# Altium schematic sheet ArbPwrBoost_P3.SchDoc: =ProjectTitle
size B; Engineer: Hab Collector; Organization: Altium Limited; Address1: 3621 Gin Way; Address2: Snellville, GA 30039; SheetNumber: 3; SheetTotal: 8
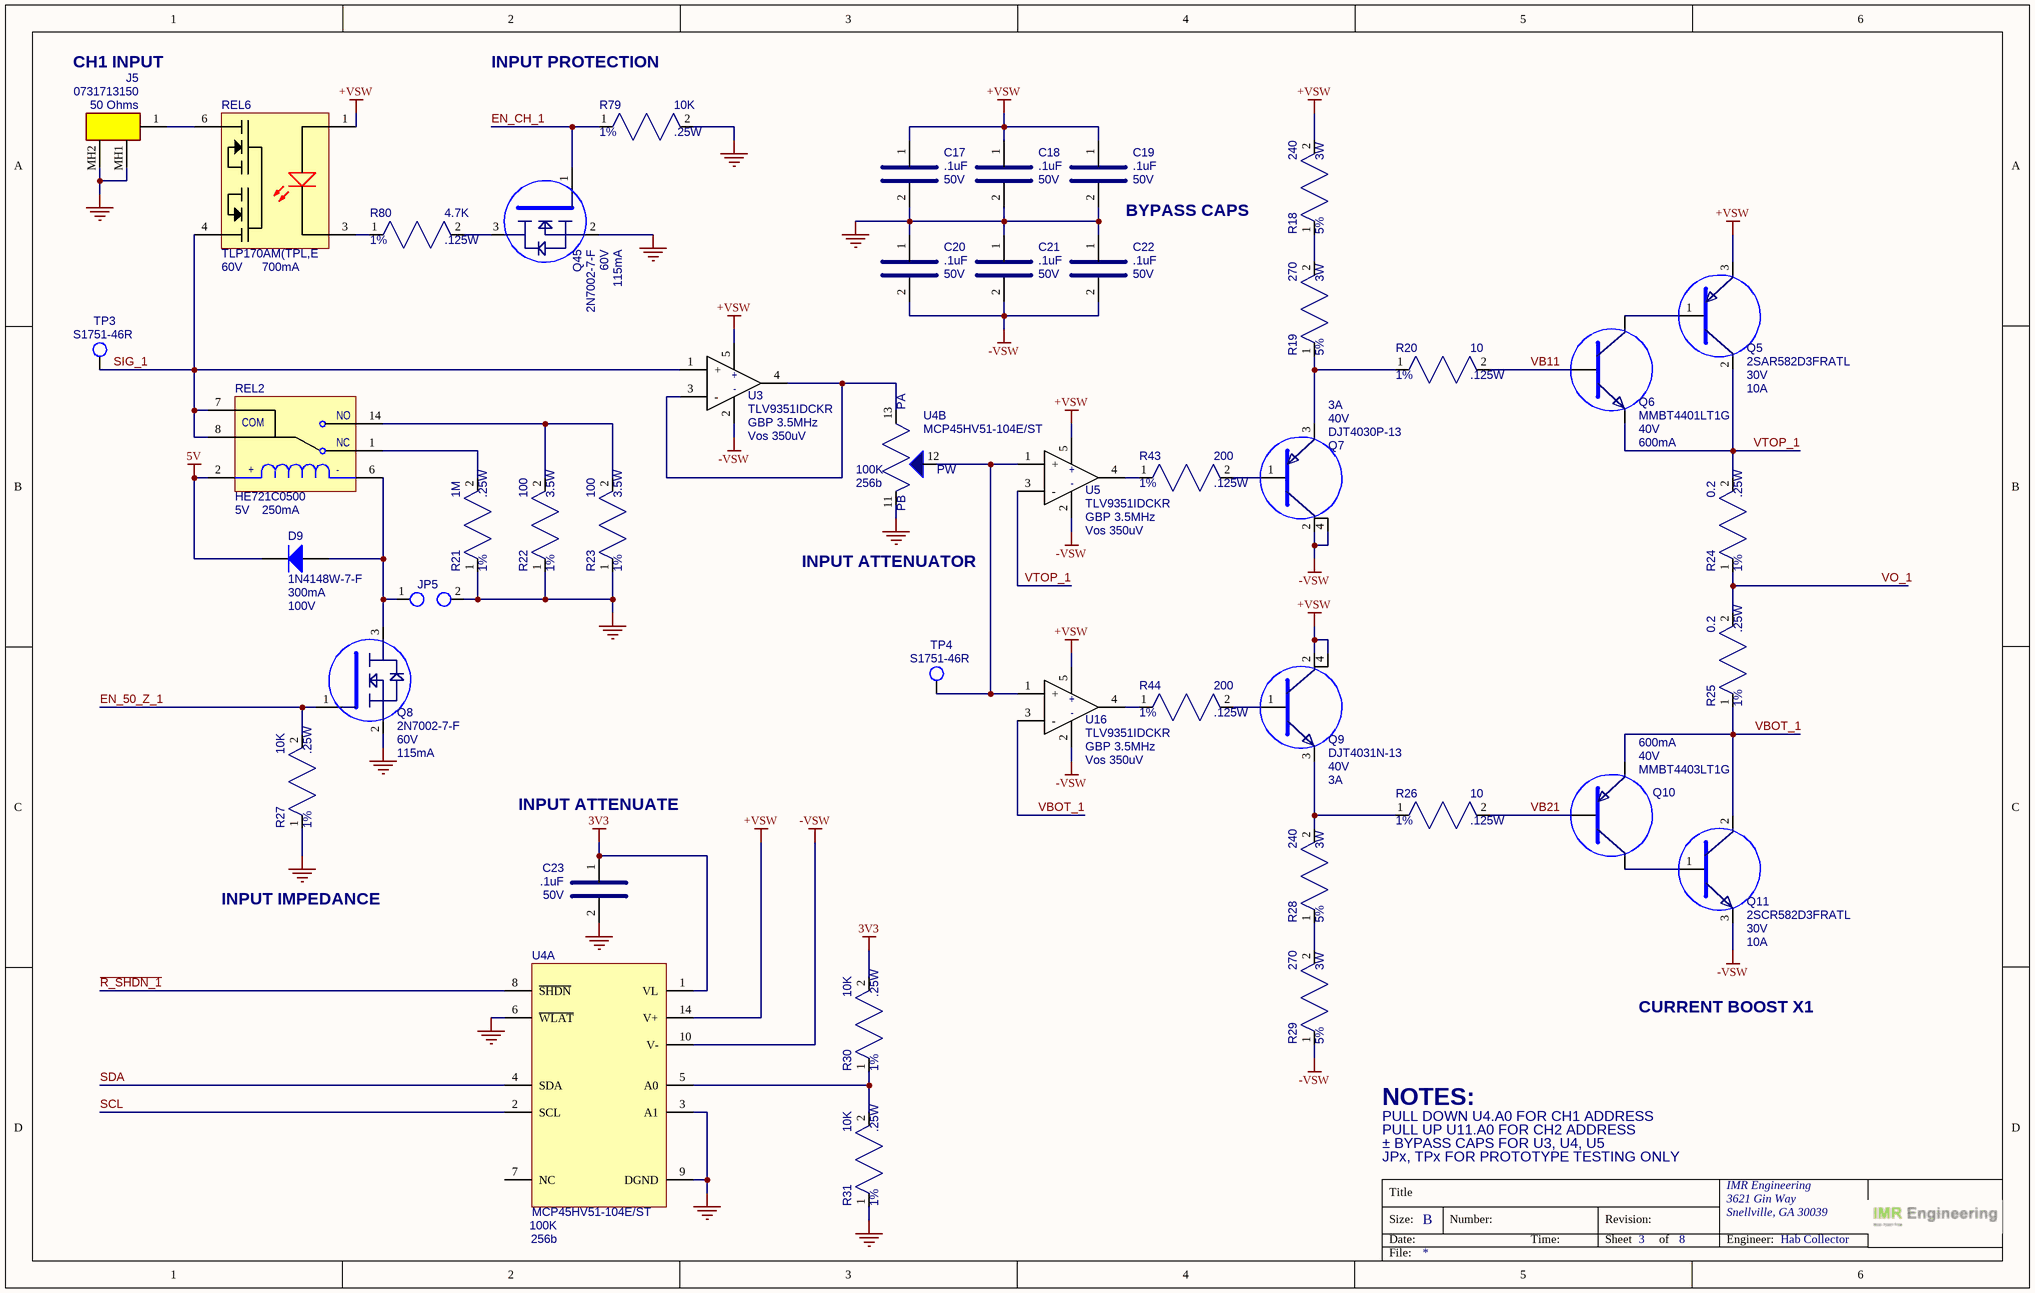
[diagram p0: ArbPwrBoost_P3.SchDoc]

## Parts
C17  value .1uF  Voltage: 50V  [CAP_0805]  (hidden comment: KGM21NR71H104KT)
C18  value .1uF  Voltage: 50V  [CAP_0805]  (hidden comment: KGM21NR71H104KT)
C19  value .1uF  Voltage: 50V  [CAP_0805]  (hidden comment: KGM21NR71H104KT)
C20  value .1uF  Voltage: 50V  [CAP_0805]  (hidden comment: KGM21NR71H104KT)
C21  value .1uF  Voltage: 50V  [CAP_0805]  (hidden comment: KGM21NR71H104KT)
C22  value .1uF  Voltage: 50V  [CAP_0805]  (hidden comment: KGM21NR71H104KT)
C23  value .1uF  Voltage: 50V  [CAP_0805]  (hidden comment: KGM21NR71H104KT)
D9  value 100V  Current: 300mA  [SOD123]  (hidden comment: 1N4148W-7-F)
J5  value 50 Ohms  [731713150]  (hidden comment: 0731713150)
JP5  PREC002SFAN-RC  [HDR_1X2_100MILL]  (value not drawn)
Q5  value 30V  Current: 10A  [TO-252]  (hidden comment: 2SAR582D3FRATL)
Q6  value 40V  Current: 600mA  [SOT-23]  (hidden comment: MMBT4401LT1G)
Q7  value 40V  Current: 3A  [SOT223]  (hidden comment: DJT4030P-13)
Q8  value 60V  Current: 115mA  [SOT-23]  (hidden comment: 2N7002-7-F)
Q9  value 40V  Current: 3A  [SOT223]  (hidden comment: DJT4031N-13)
Q10  value 40V  Current: 600mA  [SOT-23]  (hidden comment: MMBT4403LT1G)
Q11  value 30V  Current: 10A  [TO-252]  (hidden comment: 2SCR582D3FRATL)
Q45  value 60V  Current: 115mA  [SOT-23]  (hidden comment: 2N7002-7-F)
R18  value 240  Power: 3W  Tolerance: 5%  [RES_2512]  (hidden comment: RC2512JK-07240RL)
R19  value 270  Power: 3W  Tolerance: 5%  [RES_2512]  (hidden comment: RC2512JK-07270RL)
R20  value 10  Power: .125W  Tolerance: 1%  [RES_0805]  (hidden comment: RC0805FR-1310RL)
R21  value 1M  Power: .25W  Tolerance: 1%  [RES_0805]  (hidden comment: RC0805FR-7W1ML)
R22  value 100  Power: 3.5W  Tolerance: 1%  [RES_2512]  (hidden comment: ALN2512F100RE-1)
R23  value 100  Power: 3.5W  Tolerance: 1%  [RES_2512]  (hidden comment: ALN2512F100RE-1)
R24  value 0.2  Power: .25W  Tolerance: 1%  [RES_1206]  (hidden comment: RL1206FR-070R2L)
R25  value 0.2  Power: .25W  Tolerance: 1%  [RES_1206]  (hidden comment: RL1206FR-070R2L)
R26  value 10  Power: .125W  Tolerance: 1%  [RES_0805]  (hidden comment: RC0805FR-1310RL)
R27  value 10K  Power: .25W  Tolerance: 1%  [RES_0805]  (hidden comment: RC0805FR-7W10KL)
R28  value 240  Power: 3W  Tolerance: 5%  [RES_2512]  (hidden comment: RC2512JK-07240RL)
R29  value 270  Power: 3W  Tolerance: 5%  [RES_2512]  (hidden comment: RC2512JK-07270RL)
R30  value 10K  Power: .25W  Tolerance: 1%  [RES_0805]  (hidden comment: RC0805FR-7W10KL)
R31  value 10K  Power: .25W  Tolerance: 1%  [RES_0805]  (hidden comment: RC0805FR-7W10KL)
R43  value 200  Power: .125W  Tolerance: 1%  [RES_0805]  (hidden comment: RC0805FR-07200RL)
R44  value 200  Power: .125W  Tolerance: 1%  [RES_0805]  (hidden comment: RC0805FR-07200RL)
R79  value 10K  Power: .25W  Tolerance: 1%  [RES_0805]  (hidden comment: RC0805FR-7W10KL)
R80  value 4.7K  Power: .125W  Tolerance: 1%  [RES_0805]  (hidden comment: RC0805FR-134K7L)
REL2  value 5V  Current: 250mA  [HE700]  (hidden comment: HE721C0500)
REL6  value 60V  Current: 700mA  [SOP-6]  (hidden comment: TLP170AM(TPL,E)
TP3  S1751-46R  [HARWIN_S1751]
TP4  S1751-46R  [HARWIN_S1751]
U3  value GBP 3.5MHz  Vos: Vos 350uV  [SOT-353]  (hidden comment: TLV9351IDCKR)
U4  value 100K  TAP: 256b  [TSSOP-14]  (hidden comment: MCP45HV51-104E/ST)  (parts A,B of 2)
U5  value GBP 3.5MHz  Vos: Vos 350uV  [SOT-353]  (hidden comment: TLV9351IDCKR)
U16  value GBP 3.5MHz  Vos: Vos 350uV  [SOT-353]  (hidden comment: TLV9351IDCKR)

## Nets
3V3: C23.1 R30.2 U4.1(VL)
5V: D9.2(K) REL2.2
+VSW: C17.1 C18.1 C19.1 Q5.3(E) Q9.2(C) Q9.4(C) R18.2 REL6.1 U3.5 U4.14(V+) U5.5 U16.5
-VSW: C20.2 C21.2 C22.2 Q7.2(C) Q7.4(C) Q11.3(E) R29.1 U3.2 U4.10(V-) U5.2 U16.2
GND: C17.2 C18.2 C19.2 C20.1 C21.1 C22.1 C23.2 J5.MH1 J5.MH2 JP5.2 Q8.2(E) Q45.2(E) R21.1 R22.1 R23.1 R27.1 R31.1 R79.2 U4.3(A1) U4.6(~{WLAT}) U4.9(DGND) U4.11(PB0)
~{R_SHDN_1}: U4.8(~{SHDN})
EN_50_Z_1: Q8.1(B) R27.2
EN_CH_1: Q45.1(B) R79.1
SCL: U4.2(SCL)
SDA: U4.4(SDA)
SIG_1: REL2.7(COM) REL2.8(COM) REL6.4 TP3.1 U3.1(+)
VB11: Q6.1(B) R20.2
VB21: Q10.1(B) R26.2
VBOT_1: Q10.2(E) Q11.2(C) R25.1 U16.3(-)
VO_1: R24.1 R25.2
VTOP_1: Q5.2(C) Q6.2(E) R24.2 U5.3(-)
NetD9_1: D9.1(A) JP5.1 Q8.3(C) REL2.6
NetJ5_1: J5.1 REL6.6
NetQ5_1: Q5.1(B) Q6.3(C)
NetQ7_1: Q7.1(B) R43.2
NetQ7_3: Q7.3(E) R19.1 R20.1
NetQ9_1: Q9.1(B) R44.2
NetQ9_3: Q9.3(E) R26.1 R28.2
NetQ10_3: Q10.3(C) Q11.1(B)
NetQ45_3: Q45.3(C) R80.2
NetR18_1: R18.1 R19.2
NetR21_2: R21.2 REL2.1(NC)
NetR22_2: R22.2 R23.2 REL2.14(NO)
NetR28_1: R28.1 R29.2
NetR30_1: R30.1 R31.2 U4.5(A0)
NetR43_1: R43.1 U5.4
NetR44_1: R44.1 U16.4
NetR80_1: R80.1 REL6.3
NetTP4_1: TP4.1 U4.12(PW0) U5.1(+) U16.1(+)
NetU3_3: U3.3(-) U3.4 U4.13(PA)

Not connected (* = marked no-connect by the designer): U4 7(NC)

## Notes on the sheet
- CH1 INPUT
- INPUT PROTECTION
- BYPASS CAPS
- INPUT ATTENUATOR
- INPUT ATTENUATE
- INPUT IMPEDANCE
- CURRENT BOOST X1
- NOTES:
- PULL DOWN U4.A0 FOR CH1 ADDRESS
- PULL UP U11.A0 FOR CH2 ADDRESS
- ± BYPASS CAPS FOR U3, U4, U5
- JPx, TPx FOR PROTOTYPE TESTING ONLY
- Title
- Size:
- Date:
- B
- Number:
- Time:
- Revision:
- Sheet
- of
- IMR Engineering
- Engineer:
- File:
- (in symbol IC_MCP45HV51-104E/ST, part B) PW; PB
- (in symbol RELAY_HE721C0500) +; -

## Library data of the parts
C17-C23 = CAP_SMD_0.1UF_50V_0805: CAP CER 0.1UF 50V X7R 0805; MFG: KYOCERA AVX; Case/Package: 0805; MFG_PN: KGM21NR71H104KT; Supplier 1: DigiKey; Supplier Part Number 1: 478-KGM21NR71H104KTCT-ND; Unit Price: .1
D9 = DIODE_1N4148W-7-F: RELAY REED SPDT 250MA 5V; MFG: Diodes Inc; Case/Package: SOD-123; Supplier 1: DigiKey; Supplier Part Number 1: 1N4148W-FDICT-ND; Unit Price: .16; MFG_PN: 1N4148W-7-F
J5 = CONN_MOLEX_0731713150: CONN BNC RCPT R/A 50 OHM PCB; MFG: Molex; Case/Package: 73099-2; Supplier 1: DigiKey; Supplier Part Number 1: WM20430-ND; Unit Price: 1.40; MFG_PN: 0731713150
JP5 = CONN_JUMPER_2P_100MIL_VERT: CONN HEADER VERT 2POS 2.54MM; MFG: Sullins Connector Solutions; Case/Package: 2P_2.54MM; MFG_PN: PREC002SFAN-RC; Supplier 1: Digi-Key; Supplier Part Number 1: S1212EC-02-ND; Value: *; Unit Price: .07
Q5 = BJT_PNP_2SAR582D3FRATL: TRANS PNP 30V 5.7A TO-252; MFG: Rohm Semiconductor; Case/Package: TO-252; Supplier 1: DigiKey; Supplier Part Number 1: 846-2SAR582D3FRATLCT-ND; Unit Price: 1.59; MFG_PN: 2SAR582D3FRATL
Q6 = BJT_NPN_MMBT4401LT1G: TRANS NPN 40V 0.6A SOT23-3; MFG: On Semiconductor; Case/Package: SOT-23; Supplier 1: DigiKey; Supplier Part Number 1: MMBT4401LT1GOSCT-ND; Unit Price: .13; MFG_PN: MMBT4401LT1G
Q7 = BJT_PNP_DJT4030P-13: TRANS PNP 40V 3A SOT223; MFG: Diodes Inc; Case/Package: SOT-23; Supplier 1: DigiKey; Supplier Part Number 1: 31-DJT4030P-13CT-ND; Unit Price: .76; MFG_PN: DJT4030P-13
Q8 Q45 = MOSFET_NCH_2N7002-7-F: MOSFET N-CH 60V 115MA SOT23-3; MFG: Diodes Inc; Case/Package: SOT-23; Supplier 1: DigiKey; Supplier Part Number 1: 2N7002-FDICT-ND; Unit Price: .20; MFG_PN: 2N7002-7-F
Q9 = BJT_NPN_DJT4031N-13: TRANS NPN 40V 3A SOT223; MFG: Diodes Inc; Case/Package: SOT223; Supplier 1: DigiKey; Supplier Part Number 1: DJT4031NDICT-ND; Unit Price: .76; MFG_PN: DJT4031N-13
Q10 = BJT_PNP_MMBT4403LT1G: TRANS PNP 40V 0.6A SOT23-3; MFG: On Semiconductor; Case/Package: SOT-23; Supplier 1: DigiKey; Supplier Part Number 1: MMBT4403LT1GOSCT-ND; Unit Price: .13; MFG_PN: MMBT4403LT1G
Q11 = BJT_NPN_2SCR582D3FRATL: TRANS NPN 30V 10A TO-252; MFG: Rohm Semiconductor; Case/Package: TO-252; Supplier 1: DigiKey; Supplier Part Number 1: 846-2SCR582D3FRATLCT-ND; Unit Price: 1.76; MFG_PN: 2SCR582D3FRATL
R18 R28 = RES_SMD_240_2512_3W_5%: RES 240 OHM 5% 3W 2512; MFG: Yageo; Case/Package: 2512; MFG_PN: RC2512JK-07240RL; Supplier 1: DigiKey; Supplier Part Number 1: 13-RC2512JK-07240RLCT-ND; Unit Price: .28
R19 R29 = RES_SMD_270_2512_3W_5%: RES 270 OHM 5% 1W 2512; MFG: Yageo; Case/Package: 2512; MFG_PN: RC2512JK-07270RL; Supplier 1: DigiKey; Supplier Part Number 1: 13-RC2512JK-07270RLCT-ND; Unit Price: .21
R20 R26 = RES_SMD_10_0805_1/8W_1%: RES SMD 10 OHM 1% 1/8W 0805; MFG: Yageo; Case/Package: 0805; MFG_PN: RC0805FR-1310RL; Supplier 1: DigiKey; Supplier Part Number 1: 13-RC0805FR-1310RLCT-ND; Unit Price: .1
R21 = RES_SMD_1M_0805_1/4W_1%: RES SMD 1K OHM 1% 1/4W 0805; MFG: Yageo; Case/Package: 0805; MFG_PN: RC0805FR-7W1ML; Supplier 1: DigiKey; Supplier Part Number 1: 13-RC0805FR-7W1MLCT-ND; Unit Price: .10
R22 R23 = RES_SMD_100_0805_3.5W_1%: RES SMD 100 OHM 1% 3.5W 2512; MFG: Ohmite; Case/Package: 2512; MFG_PN: ALN2512F100RE-1; Supplier 1: DigiKey; Supplier Part Number 1: 273-ALN2512F100RE-1CT-ND; Unit Price: 1.50
R24 R25 = RES_SMD_0.2_1206_1/4W_1%: RES SMD 0.2 OHM 1% 1/4W 1206; MFG: Yageo; Case/Package: 1206; MFG_PN: RL1206FR-070R2L; Supplier 1: DigiKey; Supplier Part Number 1: 311-0.2LWCT-ND; Unit Price: .27
R27 R30 R31 R79 = RES_SMD_10K_0805_1/4W_1%: RES SMD 10K OHM 1% 1/4W 0805; MFG: Yageo; Case/Package: 0805; MFG_PN: RC0805FR-7W10KL; Supplier 1: DigiKey; Supplier Part Number 1: 13-RC0805FR-7W10KLCT-ND; Unit Price: .10
R43 R44 = RES_SMD_200_0805_1/8W_1%: RES SMD 200 OHM 1% 1/8W 0805; MFG: Yageo; Case/Package: 0805; MFG_PN: RC0805FR-07200RL; Supplier 1: DigiKey; Supplier Part Number 1: 311-200CRCT-ND; Unit Price: .1
R80 = RES_SMD_4.7K_0805_1/8W_1%: RES SMD 4.7K OHM 1% 1/8W 0805; MFG: Yageo; Case/Package: 0805; MFG_PN: RC0805FR-134K7L; Supplier 1: DigiKey; Supplier Part Number 1: 13-RC0805FR-134K7LCT-ND; Unit Price: .1
REL2 = RELAY_HE721C0500: RELAY REED SPDT 250MA 5V; MFG: Littlefuse; Case/Package: HE700; Supplier 1: DigiKey; Supplier Part Number 1: HE112-ND; Unit Price: 3.77; MFG_PN: HE721C0500
REL6 = RELAY_TLP170AM(TPL,E: SSR RELAY SPST-NO 700MA 0-60V; MFG: Toshiba; Case/Package: SOP-6; Supplier 1: DigiKey; Supplier Part Number 1: 264-TLP170AM(TPLECT-ND; Unit Price: 1.33; MFG_PN: TLP170AM(TPL,E
TP3 TP4 = CONN_TEST_POINT_S1751-46R: PCB TEST POINT CONNECT; MFG: Harwin Inc; Case/Package: S1751; MFG_PN: S1751-46R; Supplier 1: Digi-Key; Supplier Part Number 1: 952-1478-1-ND; Value: *; Unit Price: .28
U3 U5 U16 = OPAMP_TLV9351IDCKR: IC OPAMP GP 3.5MHZ 350uV C70-5; MFG: Texas Instruments; Package/Case: SOT-353; Supplier 1: DigiKey; MFG_PN: TLV9351IDCKR; Unit Price: .49; Supplier Part Number 1: 296-TLV9351IDCKRCT-ND
U4 = IC_MCP45HV51-104E/ST: IC DGT POT 100KOHM 256TP 14TSSOP; MFG: Microchip; Case/Package: TSSOP-14; Supplier 1: DigiKey; Supplier Part Number 1: MCP45HV51-104E/ST-ND; Unit Price: 2.00; MFG_PN: MCP45HV51-104E/ST